# Altium schematic sheet PowerPump Circuitry.SchDoc
size A4; DocumentNumber: 4; SheetNumber: 4; SheetTotal: 4
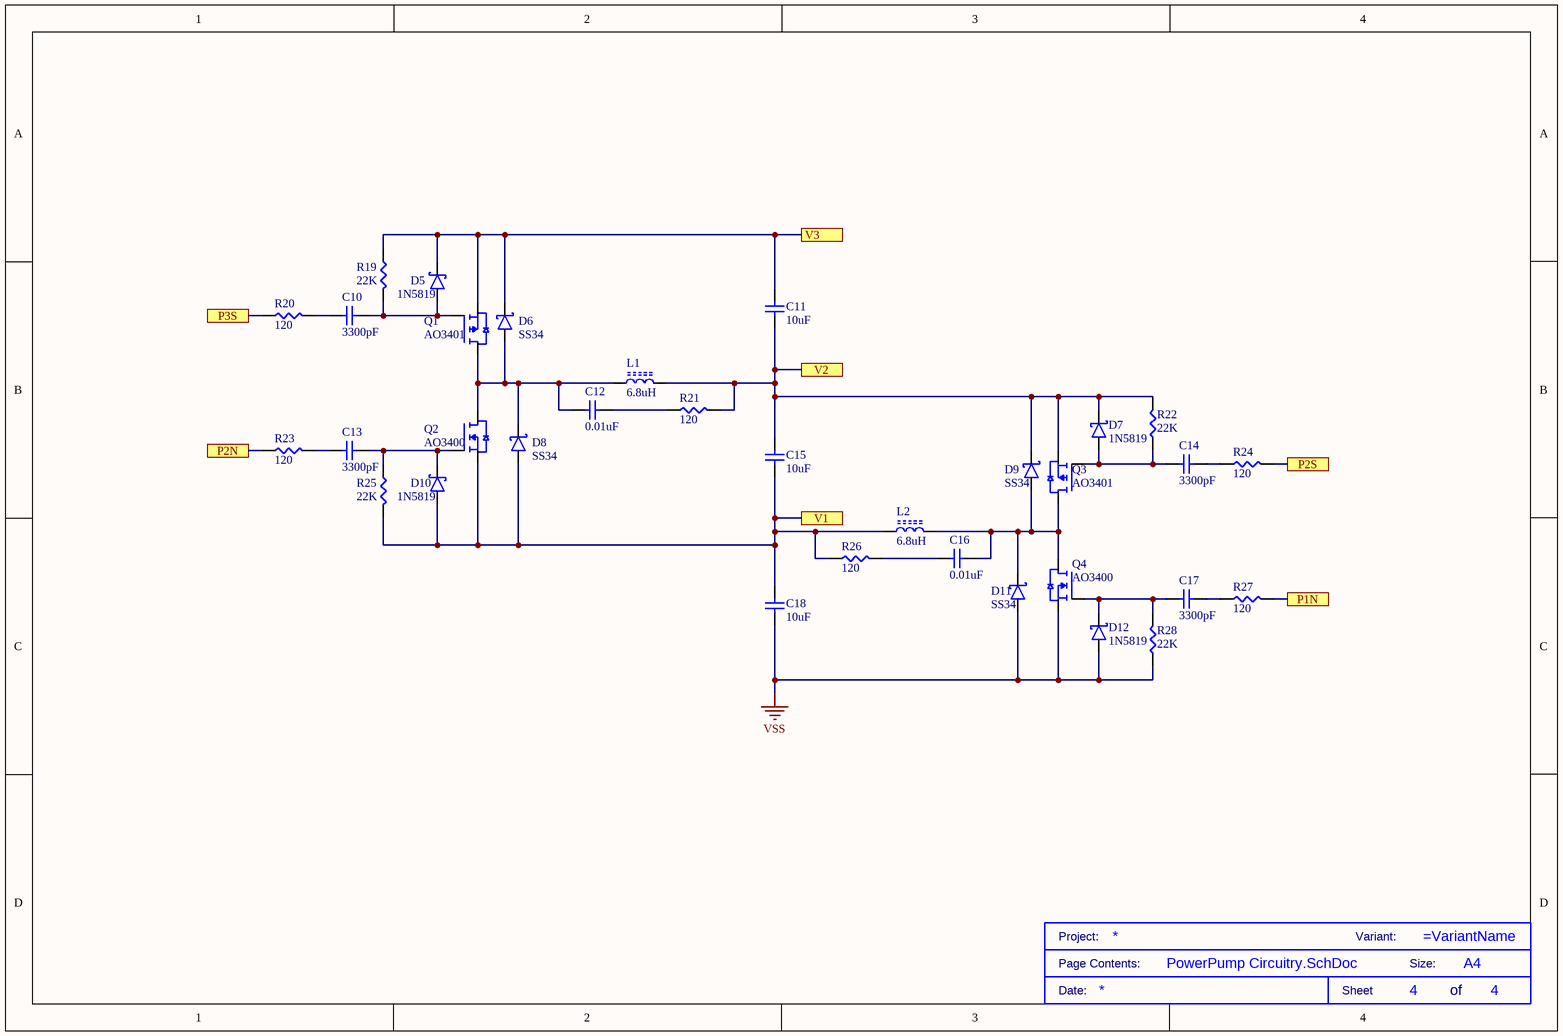
[diagram p0: PowerPump Circuitry.SchDoc]

## Parts
*  Size: A4  (hidden comment: TITLE BLOCK)  (graphical)
C10  3300pF  [C0805]
C11  10uF  [C0805]
C12  0.01uF  [C0805]
C13  3300pF  [C0805]
C14  3300pF  [C0805]
C15  10uF  [C0805]
C16  0.01uF  [C0805]
C17  3300pF  [C0805]
C18  10uF  [C0805]
D5  1N5819  [SOD123]
D6  SS34  [DO-214AA-SMB]
D7  1N5819  [SOD123]
D8  SS34  [DO-214AA-SMB]
D9  SS34  [DO-214AA-SMB]
D10  1N5819  [SOD123]
D11  SS34  [DO-214AA-SMB]
D12  1N5819  [SOD123]
L1  6.8uH  [CDRH5D28R]
L2  6.8uH  [CDRH5D28R]
Q1  AO3401  [SOT-23]
Q2  AO3400  [SOT-23]
Q3  AO3401  [SOT-23]
Q4  AO3400  [SOT-23]
R19  22K  [R0805]
R20  120  [R0805]
R21  120  [R0805]
R22  22K  [R0805]
R23  120  [R0805]
R24  120  [R0805]
R25  22K  [R0805]
R26  120  [R0805]
R27  120  [R0805]
R28  22K  [R0805]

## Ports
P1N, P2N, P2S, P3S, V1, V2, V3

## Nets
VSS: C18.2 D11.1(A) D12.1(A) Q4.2(S) R28.1
P1N: R27.2 ; port P1N
P2N: R23.1 ; port P2N
P2S: R24.2 ; port P2S
P3S: R20.1 ; port P3S
V1: C15.2 C18.1 D8.1(A) D10.1(A) L2.1 Q2.2(S) R25.1 R26.1 ; port V1
V2: C11.2 C15.1 D7.2(K) D9.2(K) L1.2 Q3.2(S) R21.2 R22.2 ; port V2
V3: C11.1 D5.2(K) D6.2(K) Q1.2(S) R19.2 ; port V3
NetC10_1: C10.1 R20.2
NetC10_2: C10.2 D5.1(A) Q1.1(G) R19.1
NetC12_1: C12.1 D6.1(A) D8.2(K) L1.1 Q1.3(D) Q2.3(D)
NetC12_2: C12.2 R21.1
NetC13_1: C13.1 R23.2
NetC13_2: C13.2 D10.2(K) Q2.1(G) R25.2
NetC14_1: C14.1 D7.1(A) Q3.1(G) R22.1
NetC14_2: C14.2 R24.1
NetC16_1: C16.1 R26.2
NetC16_2: C16.2 D9.1(A) D11.2(K) L2.2 Q3.3(D) Q4.3(D)
NetC17_1: C17.1 D12.2(K) Q4.1(G) R28.2
NetC17_2: C17.2 R27.1

## Notes on the sheet
- (in symbol TITLE BLOCK) Project:; Variant:; Page Contents:; Size:; Date:; Sheet; of

## Library data of the parts
C10 C13 C14 C17 = CAP 0805 3300pF: Cap Ceramic 0.0033uF 50V X7R 10% SMD 0805 125C Paper T/R; Manufacturer: KEMET; Manufacturer Part Number: C0805C332K5RACTU; Capacitance: 3.3nF; Dissipation Factor: 2.5%; Supplier 1: Arrow Electronics; RoHS: Yes; Category: Ceramic Capacitors; Stock 1: 104000; Pricing 1: 4000=0,00790, 40000=0,00630 (USD); Mount: Surface Mount; Case/Package: 0805; Number of Pins: 2; Case Code (Metric): 2012; Case Code (Imperial): 0805; Contact Plating: Tin,Matte; Dielectric Material: Ceramic; Min Operating Temperature: -55°C; Max Operating Temperature: 125°C; Packaging: Tape and Reel; Tolerance: 10%; Voltage Rating: 50V; Package Quantity: 1; Voltage Rating (DC): 50V; Dielectric: X7R; Termination: SMD/SMT; Voltage: 50V; Series: C; Construction: Flat; Length: 2mm; Width: 0.049inch; Height: 0.78mm; Thickness: 0.035inch; Lead Pitch: 0.75mm; Depth: 1.25mm; Radiation Hardening: No; REACH SVHC: No SVHC; RoHS Compliant: Yes; ComponentLink1URL: https://datasheet.ciiva.com/7842/kem-c1002-x7r-smd-7842598.pdf?src-supplier=Element14; ComponentLink1Description: https://datasheet.ciiva.com/7842/kem-c1002-x7r-smd-7842598.pdf?src-supplier=Element14; ComponentLink2URL: https://datasheet.ciiva.com/26948/getdatasheetpartid-385720-26948486.pdf?src-supplier=Verical; ComponentLink2Description: https://datasheet.ciiva.com/26948/getdatasheetpartid-385720-26948486.pdf?src-supplier=Verical; ComponentLink3URL: https://datasheet.ciiva.com/5415/kem-c1002-x7r-smd-357932-5415032.pdf?src-supplier=Mouser; ComponentLink3Description: https://datasheet.ciiva.com/5415/kem-c1002-x7r-smd-357932-5415032.pdf?src-supplier=Mouser; ComponentLink4URL: https://datasheet.ciiva.com/6126/kem-c1002-x7r-smd-6126698.pdf?src-supplier=Farnell; ComponentLink4Description: https://datasheet.ciiva.com/6126/kem-c1002-x7r-smd-6126698.pdf?src-supplier=Farnell; ComponentLink5URL: https://datasheet.ciiva.com/7842/1851736-7842314.pdf?src-supplier=Element14; ComponentLink5Description: https://datasheet.ciiva.com/7842/1851736-7842314.pdf?src-supplier=Element14; ComponentLink6URL: https://datasheet.ciiva.com/7842/1851736-7842315.pdf?src-supplier=Element14; ComponentLink6Description: https://datasheet.ciiva.com/7842/1851736-7842315.pdf?src-supplier=Element14; ComponentLink7URL: https://datasheet.ciiva.com/14589/70095383-14589486.pdf?src-supplier=Allied+Electronics; ComponentLink7Description: https://datasheet.ciiva.com/14589/70095383-14589486.pdf?src-supplier=Allied+Electronics; ComponentLink8URL: https://datasheet.ciiva.com/28688/1851736-28688671.pdf?src-supplier=Element14; ComponentLink8Description: https://datasheet.ciiva.com/28688/1851736-28688671.pdf?src-supplier=Element14; Supplier Part Number 1: C0805C332K5RACTU
C11 C15 C18 = CAP 0805 10uF: Cap Ceramic 10uF 10V X5R 10% SMD 0805 85C Plastic T/R; Manufacturer: KEMET; Manufacturer Part Number: C0805L106K8PACTU; Supplier 1: Mouser; RoHS: Yes; Category: Ceramic Capacitors; Stock 1: 15642; Pricing 1: 1=0,73000, 10=0,54000, 50=0,54000, 100=0,37000, 1000=0,24700, 10000=0,21500 (USD); Mount: Surface Mount; Case/Package: 0805; Case Code (Metric): 2012; Case Code (Imperial): 0805; Min Operating Temperature: -55°C; Max Operating Temperature: 85°C; Package Quantity: 4000; Capacitance: 10uF; Voltage Rating: 10V; Tolerance: 10%; Packaging: Tape and Reel; Dielectric: X5R; Termination: SMD/SMT; Voltage Rating (DC): 10V; Series: C; Length: 0.079inch; Width: 0.049inch; Thickness: 0.037inch; Depth: 1.25mm; REACH SVHC: No SVHC; RoHS Compliant: Yes; ComponentLink1URL: https://datasheet.ciiva.com/23928/1751297-23928886.pdf?src-supplier=Newark; ComponentLink1Description: https://datasheet.ciiva.com/23928/1751297-23928886.pdf?src-supplier=Newark; ComponentLink2URL: https://datasheet.ciiva.com/232/mlcclowprofile-232272.pdf?src-supplier=Digi-Key; ComponentLink2Description: https://datasheet.ciiva.com/232/mlcclowprofile-232272.pdf?src-supplier=Digi-Key; ComponentLink3URL: https://datasheet.ciiva.com/193/mlcclowprofile-193796.pdf?src-supplier=Digi-Key; ComponentLink3Description: https://datasheet.ciiva.com/193/mlcclowprofile-193796.pdf?src-supplier=Digi-Key; ComponentLink4URL: https://datasheet.ciiva.com/232/mlcclowprofile-232271.pdf?src-supplier=Digi-Key; ComponentLink4Description: https://datasheet.ciiva.com/232/mlcclowprofile-232271.pdf?src-supplier=Digi-Key; Supplier Part Number 1: 80-C0805L106K8P
C12 C16 = CAP 0805 0.01uF: Cap Ceramic 0.01uF 16V X7R 10% SMD 0805 125°C Paper T/R; Manufacturer: KEMET; Manufacturer Part Number: C0805C103K4RACTU; Capacitance: 10nF; Supplier 1: Arrow Electronics; RoHS: Yes; Category: Ceramic Capacitors; Stock 1: 24000; Pricing 1: 4000=0,07000, 8000=0,06640, 12000=0,06580, 20000=0,06310, 24000=0,05650, 100000=0,04830 (USD); Mount: Surface Mount; Case/Package: 0805; Case Code (Metric): 2012; Case Code (Imperial): 0805; Dielectric Material: Ceramic; Min Operating Temperature: -55°C; Max Operating Temperature: 125°C; Package Quantity: 1; Voltage Rating: 16V; Tolerance: 10%; Packaging: Tape and Reel; Voltage Rating (DC): 16V; Dielectric: X7R; Termination: SMD/SMT; Length: 2mm; Width: 0.049inch; Height: 0.78mm; Thickness: 0.035inch; Lead Pitch: 0.75mm; Depth: 1.25mm; Radiation Hardening: No; REACH SVHC: No SVHC; ComponentLink1URL: http://www.farnell.com/datasheets/2746090.pdf?src-supplier=Farnell; ComponentLink1Description: http://www.farnell.com/datasheets/2746090.pdf?src-supplier=Farnell; ComponentLink2URL: http://www.mouser.com/ds/2/212/KEM_C1002_X7R_SMD-1102033.pdf?src-supplier=Mouser; ComponentLink2Description: http://www.mouser.com/ds/2/212/KEM_C1002_X7R_SMD-1102033.pdf?src-supplier=Mouser; ComponentLink3URL: https://api.kemet.com/component-edge/download/datasheet/C0805C103K4RACTU.pdf?src-supplier=Digi-Key; ComponentLink3Description: https://api.kemet.com/component-edge/download/datasheet/C0805C103K4RACTU.pdf?src-supplier=Digi-Key; ComponentLink4URL: http://www.farnell.com/datasheets/1791936.pdf?src-supplier=Newark; ComponentLink4Description: http://www.farnell.com/datasheets/1791936.pdf?src-supplier=Newark; ComponentLink5URL: http://www.farnell.com/datasheets/2746090.pdf?src-supplier=Newark; ComponentLink5Description: http://www.farnell.com/datasheets/2746090.pdf?src-supplier=Newark; ComponentLink6URL: http://www.farnell.com/datasheets/2064983.pdf?src-supplier=Element14; ComponentLink6Description: http://www.farnell.com/datasheets/2064983.pdf?src-supplier=Element14; ComponentLink7URL: http://components.arrow.com/part/dataview/3450723S5469568N7429?src-supplier=Arrow+Electronics; ComponentLink7Description: http://components.arrow.com/part/dataview/3450723S5469568N7429?src-supplier=Arrow+Electronics; Supplier Part Number 1: C0805C103K4RACTU
D5 D7 D10 D12 = 1N5819HW-7-F: VR=40V IF=1A 60pF P=450mW; Manufacturer: Diodes; Forward Voltage: 450mV; Forward Current: 1A; Max Power Dissipation: 450mW; Max Reverse Current: 50uA; Element Configuration: Single; Max Repetitive Reverse Voltage (Vrrm): 40V; Max Forward Surge Current (Ifsm): 25A; Polarity: Standard; Capacitance: 110pF; Supplier 1: RSComponents; Manufacturer Part Number: 1N5819HW-7-F; RoHS: Yes; Category: Schottky Diodes; Stock 1: 100; Pricing 1: 25=0,32800, 150=0,18600, 750=0,12400, 1500=0,09400 (GBP); Case/Package: SOD-123-2; Number of Pins: 2; Weight: 0.000353oz; Contact Plating: Tin,Matte; Min Operating Temperature: -65°C; Max Operating Temperature: 125°C; Package Quantity: 3000; Packaging: Tape and Reel; Average Rectified Current: 1A; Peak Non-Repetitive Surge Current: 25A; Termination: SMD/SMT; Voltage Rating (DC): 40V; Current Rating: 1A; Output Current: 1A; Max Reverse Voltage (DC): 40V; Series: -; Length: 2.85mm; Width: 1.7mm; Height: 1.25mm; Radiation Hardening: No; REACH SVHC: No SVHC; Lead Free: Lead Free; RoHS Compliant: Yes; ComponentLink1URL: https://datasheet.ciiva.com/27092/1538419-27092484.pdf?src-supplier=Jameco; ComponentLink1Description: https://datasheet.ciiva.com/27092/1538419-27092484.pdf?src-supplier=Jameco; ComponentLink2URL: https://datasheet.ciiva.com/16303/ds30217-16303296.pdf?src-supplier=Future+Electronics; ComponentLink2Description: https://datasheet.ciiva.com/16303/ds30217-16303296.pdf?src-supplier=Future+Electronics; ComponentLink3URL: https://datasheet.ciiva.com/1177/ds30217-1177089.pdf?src-supplier=Element14; ComponentLink3Description: https://datasheet.ciiva.com/1177/ds30217-1177089.pdf?src-supplier=Element14; ComponentLink4URL: https://datasheet.ciiva.com/8303/ds30217-8303132.pdf?src-supplier=Avnet; ComponentLink4Description: https://datasheet.ciiva.com/8303/ds30217-8303132.pdf?src-supplier=Avnet; ComponentLink5URL: https://datasheet.ciiva.com/912/ds30217-912802.pdf?src-supplier=Digi-Key; ComponentLink5Description: https://datasheet.ciiva.com/912/ds30217-912802.pdf?src-supplier=Digi-Key; ComponentLink6URL: https://datasheet.ciiva.com/912/ds30217-912803.pdf?src-supplier=Digi-Key; ComponentLink6Description: https://datasheet.ciiva.com/912/ds30217-912803.pdf?src-supplier=Digi-Key; ComponentLink7URL: https://datasheet.ciiva.com/912/ds30217-912801.pdf?src-supplier=Digi-Key; ComponentLink7Description: https://datasheet.ciiva.com/912/ds30217-912801.pdf?src-supplier=Digi-Key; Supplier Part Number 1: 7082197
D6 D8 D9 D11 = SS34: Diode Schottky 3A 40V Smb; Manufacturer: Comchip; Manufacturer Part Number: SS34B-HF; Supplier 1: Mouser; RoHS: No; Stock 1: 18569; Pricing 1: 1=0,44000, 10=0,29300, 50=0,29300, 100=0,17900, 1000=0,11900, 3000=0,10200, 9000=0,09500, 10000=0,09500, 24000=0,08700, 45000=0,08400, 99000=0,08100 (USD); Supplier Part Number 1: 750-SS34B-HF
L1 L2 = CDRH5D28RHPNP-6R8NC: Ind Power 6.8uH 25% Ferrite Drum Core T/R; Manufacturer: Sumida; Supplier 1: Rutronik; Manufacturer Part Number: CDRH5D28RHPNP-6R8NC; RoHS: Yes; Category: Inductors; Stock 1: 20000; Pricing 1: 2000=0,41000, 4000=0,36900, 8000=0,36560, 12000=0,35530 (USD); RoHS Compliant: Yes; Supplier Part Number 1: IND14645
Q1 Q3 = AO3401: Trans Mosfet P-ch 30V 4A 3-PIN SOT-23 T/r; Manufacturer: Alpha & Omega Semiconductor; Manufacturer Part Number: AO3401A; Rds On Max: 44mR; Input Capacitance: 1.2nF; Max Power Dissipation: 1.4W; Number of Elements: 1; Supplier 1: LCSC; RoHS: Yes; Category: MOSFETs; Stock 1: 49175; Pricing 1: 5=0,13080, 50=0,10770, 150=0,09610, 500=0,08750, 2500=0,08060, 5000=0,07710 (USD); Mount: Surface Mount; Case/Package: TO-236-3; Number of Pins: 3; Min Operating Temperature: -55°C; Max Operating Temperature: 150°C; Packaging: Tape and Reel; Drain to Source Voltage (Vdss): 30V; Continuous Drain Current (ID): 4A; Power Dissipation: 1.4W; Series: -; Radiation Hardening: No; Lead Free: Lead Free; RoHS Compliant: Yes; ComponentLink1URL: https://datasheet.ciiva.com/940/ao3401a-940720.pdf?src-supplier=Digi-Key; ComponentLink1Description: https://datasheet.ciiva.com/940/ao3401a-940720.pdf?src-supplier=Digi-Key; ComponentLink2URL: https://datasheet.ciiva.com/26927/getdatasheetpartid-79048-26927888.pdf?src-supplier=Verical; ComponentLink2Description: https://datasheet.ciiva.com/26927/getdatasheetpartid-79048-26927888.pdf?src-supplier=Verical; Supplier Part Number 1: C15127
Q2 Q4 = AO3400: Trans MOSFET N-CH 30V 5.7A 3-Pin SOT-23; Manufacturer: Alpha & Omega Semiconductor; Manufacturer Part Number: AO3400A; Rds On Max: 26.5mR; Input Capacitance: 630pF; Max Power Dissipation: 1.4W; Number of Elements: 1; Gate to Source Voltage (Vgs): 12V; Supplier 1: TME; RoHS: Yes; Category: MOSFETs; Pricing 1: 10=0,07570, 50=0,06820, 250=0,06030, 1000=0,05410, 3000=0,05050 (EUR); Mount: Surface Mount; Case/Package: TO-236-3; Number of Pins: 3; Min Operating Temperature: -55°C; Max Operating Temperature: 150°C; Packaging: Tape and Reel; Series: -; Drain to Source Voltage (Vdss): 30V; Continuous Drain Current (ID): 5.7A; Power Dissipation: 1.4W; Radiation Hardening: No; RoHS Compliant: Yes; Lead Free: Lead Free; ComponentLink1URL: https://datasheet.ciiva.com/940/ao3400a-940739.pdf?src-supplier=Digi-Key; ComponentLink1Description: https://datasheet.ciiva.com/940/ao3400a-940739.pdf?src-supplier=Digi-Key; ComponentLink2URL: https://datasheet.ciiva.com/26906/getdatasheetpartid-64438-26906526.pdf?src-supplier=Verical; ComponentLink2Description: https://datasheet.ciiva.com/26906/getdatasheetpartid-64438-26906526.pdf?src-supplier=Verical; ComponentLink3URL: https://datasheet.ciiva.com/940/ao3400a-940740.pdf?src-supplier=Digi-Key; ComponentLink3Description: https://datasheet.ciiva.com/940/ao3400a-940740.pdf?src-supplier=Digi-Key; ComponentLink4URL: https://datasheet.ciiva.com/940/ao3400a-940741.pdf?src-supplier=Digi-Key; ComponentLink4Description: https://datasheet.ciiva.com/940/ao3400a-940741.pdf?src-supplier=Digi-Key; Supplier Part Number 1: AO3400A
R19 R22 R25 R28 = RES 0805 22K: CRCW Series 0805 0.125 W 22 KOhm ±5 % ±200 ppm/K SMT Thick Film Chip Resistor; Manufacturer: Vishay; Manufacturer Part Number: CRCW080522K0JNEAC; Supplier 1: Newark; ComponentLink1URL: http://datasheet.octopart.com/CRCW080522K0JNEAC-Vishay-datasheet-100063072.pdf?src-supplier=Future+Electronics; ComponentLink1Description: http://datasheet.octopart.com/CRCW080522K0JNEAC-Vishay-datasheet-100063072.pdf?src-supplier=Future+Electronics; Supplier Part Number 1: 59AC3958
R20 R21 R23 R24 R26 R27 = RES 0805 120: Res 120 Ohm 5% 1/8W 0805; Manufacturer: Vishay; Manufacturer Part Number: CRCW0805120RJNEAC; Supplier 1: TTI; Pricing 1: 60000=0,00353 (USD); Supplier Part Number 1: CRCW0805120RJNEAC